# EAGLE design pc_healthypi_pro_carrier_5.2 (EAGLE 9.6.2)
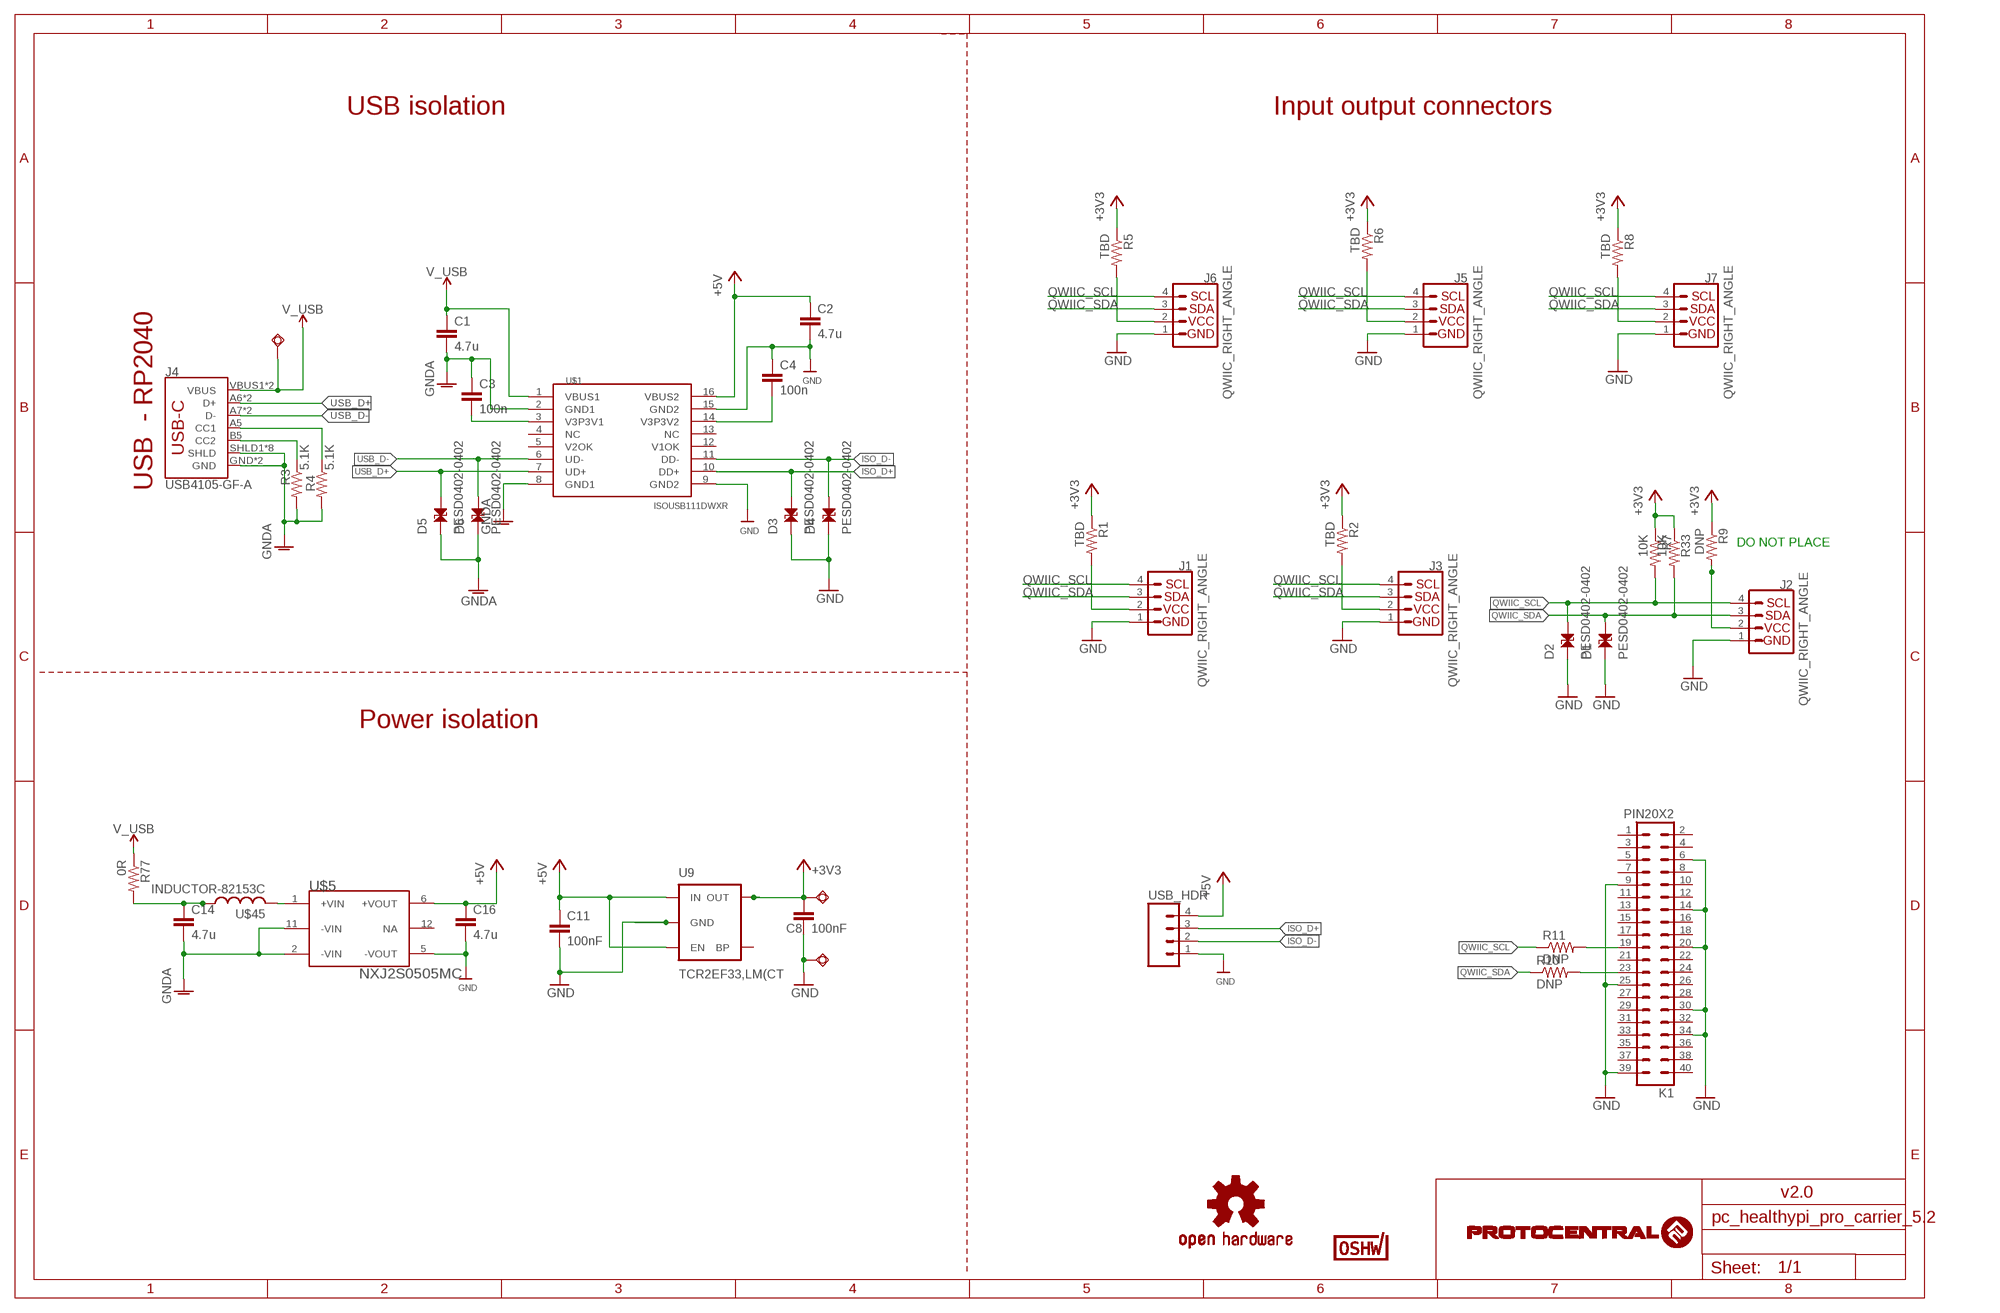
[diagram p0: schematic, sheet 1]

## Parts
C1  4.7u  C-EUC0805  [C0805]
C2  4.7u  C-EUC0805  [C0805]
C3  100n  C-EUC0402  [C0402]
C4  100n  C-EUC0402  [C0402]
C8  100nF  C-EUC0402  [C0402]
C11  100nF  C-EUC0402  [C0402]
C14  4.7u  C-EUC0805  [C0805]
C16  4.7u  C-EUC0805  [C0805]
D1  PESD0402-0402  [0402]
D2  PESD0402-0402  [0402]
D3  PESD0402-0402  [0402]
D4  PESD0402-0402  [0402]
D5  PESD0402-0402  [0402]
D6  PESD0402-0402  [0402]
J1  QWIIC_RIGHT_ANGLE  QWIIC_CONNECTORJS-1MM  [JST04_1MM_RA]
J2  QWIIC_RIGHT_ANGLE  QWIIC_CONNECTORJS-1MM  [JST04_1MM_RA]
J3  QWIIC_RIGHT_ANGLE  QWIIC_CONNECTORJS-1MM  [JST04_1MM_RA]
J4  USB4105-GF-A  USB_C16PIN  [USB-C-16P]
J5  QWIIC_RIGHT_ANGLE  QWIIC_CONNECTORJS-1MM  [JST04_1MM_RA]
J6  QWIIC_RIGHT_ANGLE  QWIIC_CONNECTORJS-1MM  [JST04_1MM_RA]
J7  QWIIC_RIGHT_ANGLE  QWIIC_CONNECTORJS-1MM  [JST04_1MM_RA]
K1  PIN20X2  [PIN_20X2]
R1  TBD  R-US_R0402  [R0402]
R2  TBD  R-US_R0402  [R0402]
R3  5.1K  R-US_R0402  [R0402]
R4  5.1K  R-US_R0402  [R0402]
R5  TBD  R-US_R0402  [R0402]
R6  TBD  R-US_R0402  [R0402]
R7  10K  R-US_R0402  [R0402]
R8  TBD  R-US_R0402  [R0402]
R9  DNP  R-US_R0402  [R0402]
R10  DNP  R-US_R0402  [R0402]
R11  DNP  R-US_R0402  [R0402]
R33  10K  R-US_R0402  [R0402]
R77  0R  R-US_R0805  [R0805]
SWIO5  TPSQTP11R  [TP11R]
SWIO6  TPSQTP11R  [TP11R]
TP8  TPSQTP11R  [TP11R]
U9  TCR2EF33,LM(CT  V_REG_LDOSMD  [SOT23-5]
U$1  ISOUSB111DWXR  [SSOP-16-5.85X7.5]
U$5  NXJ2S0505MC  [NXJ2S0505MC]
U$13  CERT-SMALL  [CERT-SMALL-SILK]
U$42  OSHW-LOGOM  [OSHW-LOGO-M]
U$45  INDUCTOR-82153C  [INDUCTOR-8200]
USB_HDR  M04LOCK_LONGPADS  [1X04_LOCK_LONGPADS]

## Nets
+3V3: C8.1 R1.1 R2.1 R5.1 R6.1 R7.1 R8.1 R9.1 R33.1 SWIO5.TP U9.5(OUT)
+5V: C2.1 C11.1 C16.1 U9.1(IN) U9.3(EN) U$1.16(VBUS2) U$5.6(+VOUT) USB_HDR.4
GND: C2.2 C4.1 C8.2 C11.2 C16.2 D1.1 D2.1 D3.1 D4.1 J1.1 J2.1 J3.1 J5.1 J6.1 J7.1 K1.6 K1.9 K1.14 K1.20 K1.25 K1.30 K1.34 K1.39 SWIO6.TP U9.2(GND) U$1.9(GND2) U$1.15(GND2) U$5.5(-VOUT) USB_HDR.1
GNDA: C1.2 C3.1 C14.2 D5.1 D6.1 J4.GND J4.GND2(GND) J4.SHLD1(SHLD) J4.SHLD2(SHLD) J4.SHLD3(SHLD) J4.SHLD4(SHLD) J4.SHLD5(SHLD) J4.SHLD6(SHLD) J4.SHLD7(SHLD) J4.SHLD8(SHLD) R3.2 R4.2 U$1.2(GND1) U$1.8(GND1) U$5.2(-VIN) U$5.11(-VIN)
ISO_D+: D3.2 U$1.10(DD+) USB_HDR.3
ISO_D-: D4.2 U$1.11(DD-) USB_HDR.2
N$1: J1.2 R1.2
N$2: J3.2 R2.2
N$3: J6.2 R5.2
N$4: J5.2 R6.2
N$5: J7.2 R8.2
N$6: J2.2 R9.2
N$7: C3.2 U$1.3(V3P3V1)
N$8: C4.2 U$1.14(V3P3V2)
N$29: K1.23 R10.2
N$30: K1.19 R11.2
N$33: J4.B5(CC2) R3.1
N$34: J4.A5(CC1) R4.1
N$39: U$5.1(+VIN) U$45.P$2
N$46: C14.1 R77.2 U$45.P$1
QWIIC_SCL: D2.2 J1.4 J2.4 J3.4 J5.4 J6.4 J7.4 R7.2 R11.1
QWIIC_SDA: D1.2 J1.3 J2.3 J3.3 J5.3 J6.3 J7.3 R10.1 R33.2
USB_D+: D5.2 J4.A6(D+) J4.B6(D+) U$1.7(UD+)
USB_D-: D6.2 J4.A7(D-) J4.B7(D-) U$1.6(UD-)
V_USB: C1.1 J4.VBUS1(VBUS) J4.VBUS2(VBUS) R77.1 TP8.TP U$1.1(VBUS1)
Unconnected: K1.1 K1.2 K1.3 K1.4 K1.5 K1.7 K1.8 K1.10 K1.11 K1.12 K1.13 K1.15 K1.16 K1.17 K1.18 K1.21 K1.22 K1.24 K1.26 K1.27 K1.28 K1.29 K1.31 K1.32 K1.33 K1.35 K1.36 K1.37 K1.38 K1.40 U9.4(BP) U$1.4(NC) U$1.5(V2OK) U$1.12(V1OK) U$1.13(NC) U$5.12(NA)

## Notes on the sheet
- USB isolation | Input output connectors
- USB  - RP2040
- DO NOT PLACE
- Power isolation
- v2.0

## Library data of the parts
C1-C4 C8 C11 C14 C16 = rcl:C-EU: CAPACITOR, European symbol; SPICEPREFIX: C
D1-D6 = SparkFun-DiscreteSemi:PESD0402: ESD protection diode PESD is used to protect a signal line from ESD.; DIGIKEY_PART: PESD0402-140CT-ND; MOUSE_PART: 650-PESD0402-140; PROD_ID: DIO-15359
J1-J3 J5-J7 = SparkFun-Connectors:QWIIC_CONNECTOR: SparkFun I2C Standard Qwiic Connector An SMD 1mm pitch JST connector makes it easy and quick (get it? Qwiic?) to connect I2C devices to each other. The Qwiic system <http://www.sparkfun.com/qwiic> enables fast and solderless connection between popular platforms and various sensors and actuators. We carry 200mm <https://www.sparkfun.com/products/14204>, 100mm <https://www.sparkfun.com/products/14205>, 50mm <https://www.sparkfun.com/products/14206>, and breadboard friendly <https://www.sparkfun.com/products/14207> Qwiic cables. We also offer 10 pcs strips <https://www.sparkfun.com/products/14323> the SMD connectors.; PROD_ID: CONN-13694
J4 = circuitects:USB_C: USB Type C 16Pin Connector
K1 = FLYFISH:PIN20X2
R1-R11 R33 = rcl:R-US_: RESISTOR, American symbol; SPICEPREFIX: R
R77 = rcl:R-US_: RESISTOR, American symbol
SWIO5 SWIO6 TP8 = testpad:TPSQ: Test pad
U9 = SparkFun-PowerIC:V_REG_LDO: Voltage Regulator LDO Standard 150mA LDO voltage regulator in SOT-23 layout. Micrel part MIC5205. BP (by-pass) pin is used to lower output noise with 470pF cap.; PROD_ID: VREG-12457
U$1 = circuitects:ISOUSB111DWXR
U$5 = circuitects:NXJ2S0505MC
U$13 = OSHWA:CERT
U$42 = SparkFun:OSHW-LOGO: Open Source Hardware Logo This logo indicates the piece of hardware it is found on incorporates a OSHW license and/or adheres to the definition of open source hardware found here: http://freedomdefined.org/OSHW
U$45 = circuitects:INDUCTOR-82153C
USB_HDR = SparkFun:M04: Header 4 Standard 4-pin 0.1" header. Use with straight break away headers (SKU : PRT-00116), right angle break away headers (PRT-00553), swiss pins (PRT-00743), machine pins (PRT-00117), and female headers (PRT-00115). Molex polarized connector foot print use with SKU : PRT-08231 with associated crimp pins and housings. 1MM SMD Version SKU: PRT-10208

## Net classes
1 power: width 0.178 mm
2 Clock: width 0.089 mm, clearance 0.178 mm
4 USBpair: width 0.102 mm, drill 0.1 mm, clearance 0.15 mm to class 3

## Board
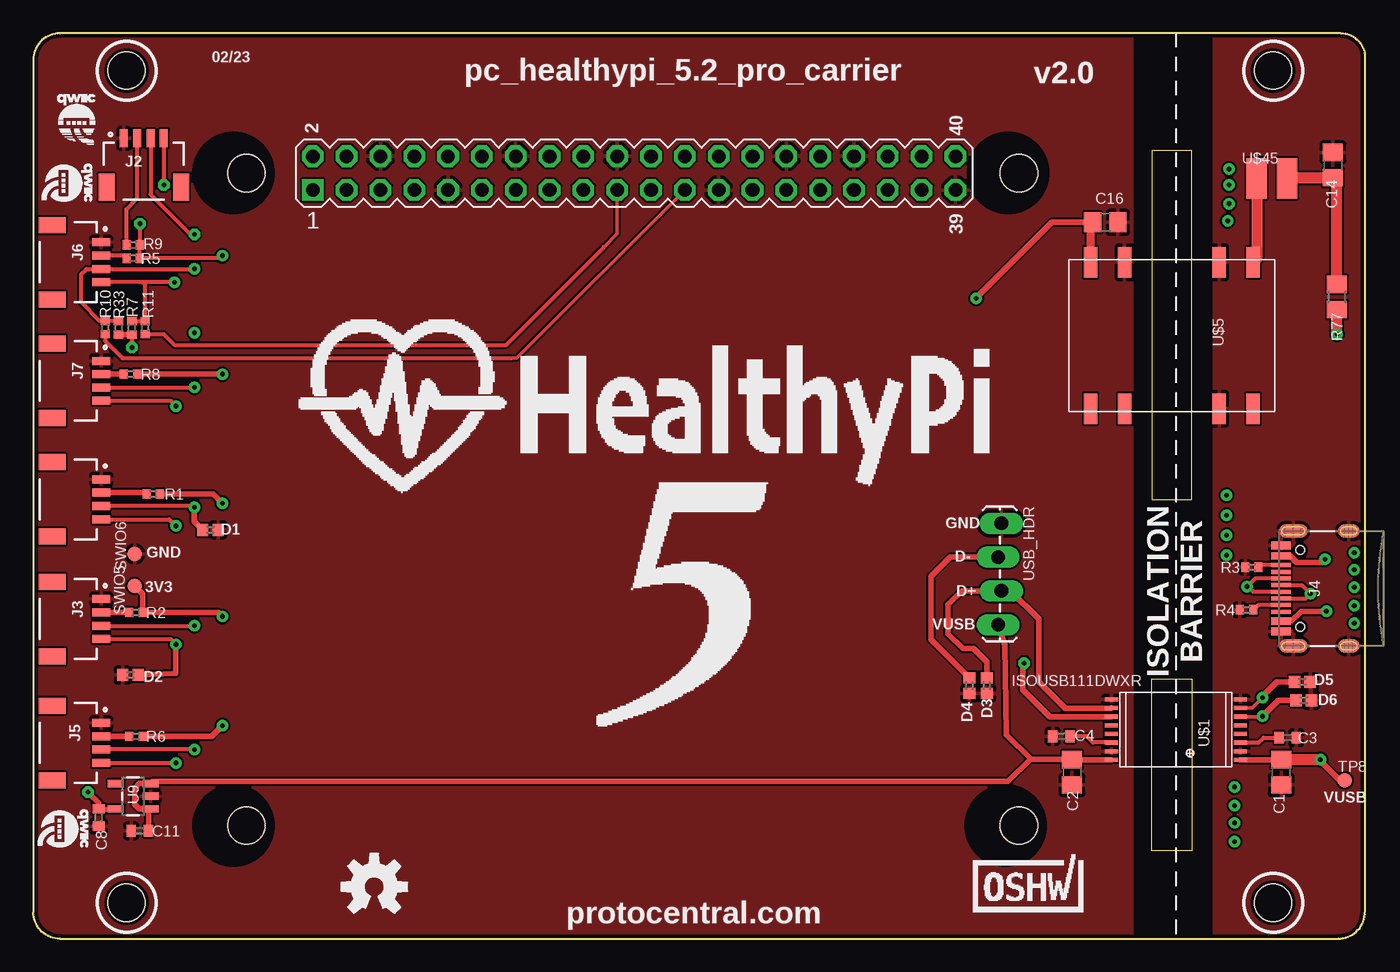
[diagram p1: board, top side]
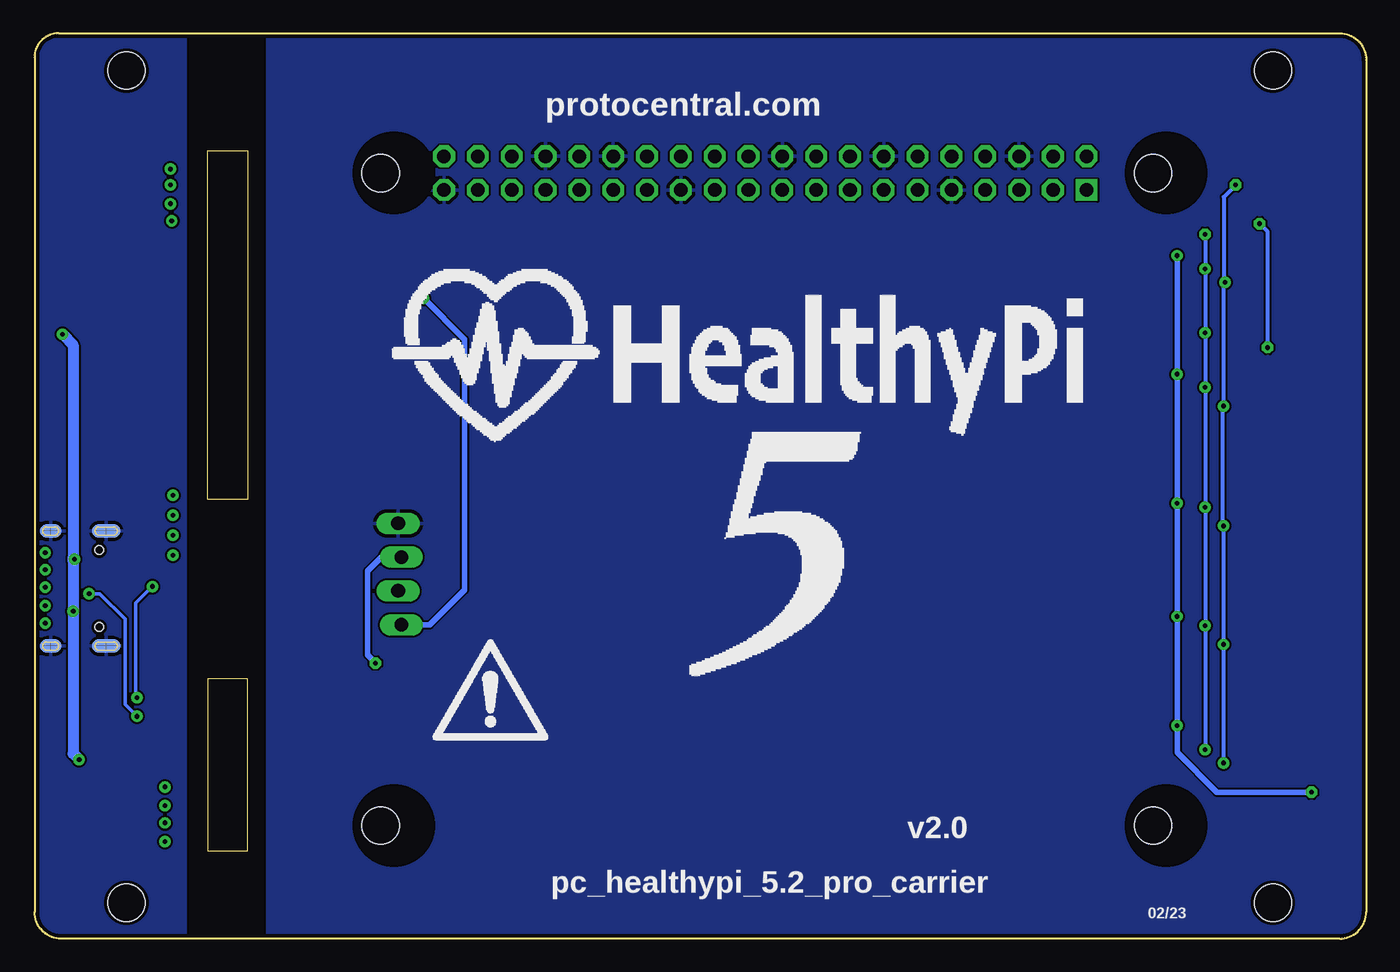
[diagram p2: board, bottom side, seen from below]

Size 100 x 68 mm. Coordinates in mm from the lower left corner, seen from the top.
Outline: 0,66 0,2 arc90 2,0 98,0 arc90 100,2 100,66.2 arc90 98.2,68 2,68 arc90 0,66
Outline: 84,59.2 84,33 87,33 87,59.2 84,59.2
Outline: 84,19.5 87,19.5 87,6.6 84,6.6 84,19.5
Copper layers (1*16): Top 0.035mm / dielectric 1.5mm / Bottom 0.035mm
Design rules "Circuitects-Rules *": minimum track width 6mil, minimum drill 0.1mm, track to track 6mil, track to pad 6mil, pad to pad 6mil, via to via 6mil, smd to smd 6mil, copper to edge 10mil, drill to drill 4mil, minimum pad ring 12mil, minimum via ring 10mil, stop-mask expansion 4mil, vias tented up to drill 25mil, thermal gap 10mil
Holes 2.8 mm at 16.02,8.5 16.02,57.5 74.02,57.5 74.02,8.5 7,2.7 93.1,2.7 7,65.2 93.1,65.2
tRestrict: area 13.5,55.9 to 16.6,59; area 71.7,55.9 to 74.8,59; area 71.5,6.9 to 74.6,10; area 13.5,6.9 to 16.6,10
bRestrict: area 13.5,6.9 to 16.6,10; area 13.5,55.9 to 16.6,59; area 71.5,6.9 to 74.6,10; area 71.5,55.9 to 74.6,59

### Footprints (pad centres in the part's own frame; a part is rotated, then mirrored left to right if it is on the bottom)
C0805 = smd 1.3 x 1.5: 1 -0.95,0; 2 0.95,0
C0402 = smd 0.7 x 0.9: 1 -0.65,0; 2 0.65,0
0402 = smd 0.85 x 0.9: 1 -0.58,0; 2 0.58,0
JST04_1MM_RA = smd 0.6 x 1.35: 1 -1.5,0; 2 -0.5,0; 3 0.5,0; 4 1.5,0 | smd 1.2 x 2: NC1 2.8,-3.675; NC2 -2.8,-3.675
USB-C-16P = smd 0.3 x 1.45: A5 -1.25,0; A6 -0.25,0; A7 0.25,0; A8 1.25,0; B5 1.75,0; B6 0.75,0; B7 -0.75,0; B8 -1.75,0 | smd 0.6 x 1.45: GND -3.225,0; GND2 3.225,0 | smd 1 x 2.1: SHLD1 -4.32,-0.915; SHLD2 4.32,-0.915 | smd 1 x 2.1 bottom: SHLD3 -4.32,-0.915; SHLD4 4.32,-0.915 | smd 1 x 1.6: SHLD5 -4.32,-5.095; SHLD8 4.32,-5.095 | smd 1 x 1.6 bottom: SHLD6 -4.32,-5.095; SHLD7 4.32,-5.095 | smd 0.55 x 1.45: VBUS1 -2.45,0; VBUS2 2.45,0 | hole 0.65: -2.89,-1.445; 2.89,-1.445
PIN_20X2 = drill 1.016 square: 1 -24.13,-1.27 | drill 1.016 octagon: 2 -24.13,1.27; 3 -21.59,-1.27; 4 -21.59,1.27; 5 -19.05,-1.27; 6 -19.05,1.27; 7 -16.51,-1.27; 8 -16.51,1.27; 9 -13.97,-1.27; 10 -13.97,1.27; 11 -11.43,-1.27; 12 -11.43,1.27; 13 -8.89,-1.27; 14 -8.89,1.27; 15 -6.35,-1.27; 16 -6.35,1.27; 17 -3.81,-1.27; 18 -3.81,1.27; 19 -1.27,-1.27; 20 -1.27,1.27; 21 1.27,-1.27; 22 1.27,1.27; 23 3.81,-1.27; 24 3.81,1.27; 25 6.35,-1.27; 26 6.35,1.27; 27 8.89,-1.27; 28 8.89,1.27; 29 11.43,-1.27; 30 11.43,1.27; 31 13.97,-1.27; 32 13.97,1.27; 33 16.51,-1.27; 34 16.51,1.27; 35 19.05,-1.27; 36 19.05,1.27; 37 21.59,-1.27; 38 21.59,1.27; 39 24.13,-1.27; 40 24.13,1.27
R0402 = smd 0.6 x 0.7: 1 -0.5,0; 2 0.5,0
R0805 = smd 1.3 x 1.5: 1 -0.95,0; 2 0.95,0
TP11R = smd 1.1 x 1.1: TP 0,0
SOT23-5 = smd 0.55 x 1.2: 1 -0.95,-1.3; 2 0,-1.3; 3 0.95,-1.3; 4 0.95,1.3; 5 -0.95,1.3
SSOP-16-5.85X7.5 = smd 0.991 x 0.305: 1 -4.85,2.275; 2 -4.85,1.625; 3 -4.85,0.975; 4 -4.85,0.325; 5 -4.85,-0.325; 6 -4.85,-0.975; 7 -4.85,-1.625; 8 -4.85,-2.275; 9 4.85,-2.275; 10 4.85,-1.625; 11 4.85,-0.975; 12 4.85,-0.325; 13 4.85,0.325; 14 4.85,0.975; 15 4.85,1.625; 16 4.85,2.275
NXJ2S0505MC = smd 1 x 2.3: 1 -6.095,-5.5; 2 -3.55,-5.5; 5 3.55,-5.5; 6 6.095,-5.5; 7 6.095,5.5; 8 3.55,5.5; 11 -3.55,5.5; 12 -6.095,5.5
INDUCTOR-8200 = smd 1.52 x 3.05: P$1 -1.145,0; P$2 1.145,0
1X04_LOCK_LONGPADS = drill 1.016 long: 1 0,0; 2 2.54,-0.254; 3 5.08,0; 4 7.62,-0.254

### Placement (x,y rotation side)
C1  93.7,12.5 270 top
C2  78,12.5 270 top
C3  94.2,15.1 180 top
C4  77.2,15.2 0 top
C8  4.9,9.1 270 top
C11  8,8.1 180 top
C14  97.6,58.1 90 top
C16  80.5,53.8 0 top
D1  13.3,30.7 180 top
D2  7.3,19.8 0 top
D3  71.6,19 90 top
D4  70.3,19 90 top
D5  95.3,19.3 180 top
D6  95.4,17.9 180 top
J1  5.1,33 270 top
J2  8.3,60.12 0 top
J3  5.1,24 270 top
J4  93.7,26.3 90 top
J5  5.1,14.7 270 top
J6  5.1,50.8 270 top
J7  5.1,41.9 270 top
K1  45.12,57.5 0 top
R1  9,33.4 180 top
R2  7.7,24.5 180 top
R3  91.5,27.9 180 top
R4  91.1,24.7 180 top
R5  7.5,51.1 180 top
R6  7.7,15.2 180 top
R7  7.4,45.88 90 top
R8  7.3,42.4 180 top
R9  7.5,52.1 180 top
R10  5.4,45.9 270 top
R11  8.4,45.9 270 top
R33  6.4,45.88 90 top
R77  97.9,48.2 90 top
SWIO5  7.6,26.5 90 top
SWIO6  7.6,28.9 90 top
TP8  98.5,11.9 0 top
U9  7.5,10.7 90 top
U$1  85.8,15.7 180 top
U$5  85.5,45.3 180 top
U$6  [QWIIC#LABEL#FULL#M#PNG]  2.53,56.83 270 top
U$7  [HEALTHYPIV5LOGO]  20,16 0 top
U$13  74.7,2 0 top
U$15  [QWIIC#LABEL#FULL#M#PNG]  3.17,61.53 0 top
U$17  [WARNINGSYM]  70.2,14.8 0 bottom
U$20  [HEALTHYPIV5LOGO]  73.1,19.8 0 bottom
U$42  25.6,3.9 0 top
U$45  93,57.1 180 top
U$59  [QWIIC#LABEL#FULL#M#PNG]  2.23,8.33 270 top
USB_HDR  72.7,31.2 270 top

### Tracks (layer width: path | path; a pad name or v marks a point on that pad's centre or on a via)
+3V3  (via drill 0.35)
  Top 0.305: v14.2,51.3 14,51.1 R5.1 R9.1 v8,53.7 | R7.1 v7.4,44.4
  Top 0.406: R8.1 v14.2,42.4 | R6.1 13.4,15.2 v14.2,16 | R1.1 13.5,33.4 v14.2,32.7 | v14.2,24.2 13.9,24.5 R2.1 8.2,25.9 SWIO5.TP | U9.5 5,9.67 C8.1 4.9,10.2 v4.1,11 | R33.1 R7.1
  Bottom 0.305: v7.4,44.4 7.4,53.1 v8,53.7
  Bottom 0.406: v14.2,51.3 v14.2,42.4 v14.2,32.7 v14.2,24.2 v14.2,16 14.2,14 11.2,11 v4.1,11
+5V  (via drill 0.35)
  Top 0.406: U$1.16 78.03,13.43 C2.1 | 77.95,13.5 C2.1 | 79.41,53.01 C16.1 76.5,53.8 v70.8,48.1 | C2.1 74.95,13.45 74.9,13.5 | USB_HDR.4 72.98,22.05 73.08,15.32 74.9,13.5 | 74.9,13.5 73.2,11.8 8.95,11.8 U9.3 7.95,11.65 7.6,11.3 7.6,10.1 7.95,9.75 U9.1 8.65,9.6 C11.1
  Top 0.61: U$5.6 79.41,53.01
  Bottom 0.406: USB_HDR.4 70.32,23.58 67.7,26.2 67.7,45 v70.8,48.1
GND
  pour Bottom: -1,-0.2 82.5,-0.2 82.5,68 0.84,68 arc90 -1,65.47
  pour Top: -1,-0.2 82.5,-0.2 82.5,68 -1,68
GNDA
  pour Top: 88.7,68 101,68 101,0 88.7,0
  pour Bottom: 88.7,68 88.7,0 101,0 101,68
ISO_D+
  Top 0.406: U$1.10 80.92,17.3 77.5,17.3 75.5,19.3 75.5,24 73.38,26.12 USB_HDR.3 69.72,26.12 68.7,25.1 68.7,22.9 69.8,21.8 70.6,21.8 71.6,20.8 D3.2
ISO_D-  (via drill 0.35)
  Top 0.406: U$1.11 76.33,16.68 74.3,18.7 74.3,20.6 v74.4,20.7 | D4.2 67.4,22.48 67.4,27.2 68.86,28.66 USB_HDR.2
  Bottom 0.406: v74.4,20.7 75,21.3 75,27.6 73.94,28.66 USB_HDR.2
N$1
  Top 0.152: R1.2 8.4,33.5
  Top 0.406: 8.4,33.5 J1.2
N$2
  Top 0.406: R2.2 J3.2
N$3
  Top 0.305: J6.2 5.3,51.3 | 5.3,51.3 | R5.2 6.8,51.3 5.3,51.3
N$4
  Top 0.406: R6.2 J5.2
N$5
  Top 0.406: J7.2 R8.2
N$6
  Top 0.305: R9.2 7,54.8 7.8,55.6 J2.2
N$7
  Top 0.305: U$1.3 92.03,14.72 92.4,15.1 C3.2
N$8
  Top 0.305: U$1.14 79.58,14.72 79.1,15.2 C4.2
N$10  (via drill 0.35)
  other vias: 90.2,11.4
N$11  (via drill 0.35)
  other vias: 90.2,10
N$12  (via drill 0.35)
  other vias: 90.2,8.7
N$13  (via drill 0.35)
  other vias: 90.2,7.3
N$14  (via drill 0.35)
  other vias: 99.2,29
N$15  (via drill 0.35)
  other vias: 99.2,27.7
N$16  (via drill 0.35)
  other vias: 99.2,26.4
N$17  (via drill 0.35)
  other vias: 99.2,25
N$18  (via drill 0.35)
  other vias: 99.2,23.7
N$19  (via drill 0.35)
  other vias: 89.8,57.8
N$20  (via drill 0.35)
  other vias: 89.7,53.9
N$21  (via drill 0.35)
  other vias: 89.8,55.2
N$23  (via drill 0.35)
  other vias: 89.8,56.6
N$25  (via drill 0.35)
  other vias: 89.6,33.3
N$26  (via drill 0.35)
  other vias: 89.6,31.8
N$27  (via drill 0.35)
  other vias: 89.6,30.3
N$28  (via drill 0.35)
  other vias: 89.6,28.8
N$29
  Top 0.254: 35.9,43.6 36.3,43.6 K1.23
  Top 0.305: R10.2 5.4,44.9 6.7,43.6 35.9,43.6
N$30
  Top 0.254: 42.85,51.95 43.85,52.95 K1.19
  Top 0.305: R11.2 9.8,45.4 10.6,44.6 35.5,44.6 42.85,51.95
N$33
  Top 0.152: 92.15,28.05 R3.1
  Top 0.305: J4.B5 92.15,28.05
N$34
  Top 0.305: J4.A5 91.98,25.05 R4.1
N$39
  Top 0.406: 91.89,57.06 U$45.P$2
  Top 0.61: U$5.1 91.89,51.1
  Top 0.813: 91.89,57.06 91.89,51.1
N$46
  Top 0.406: U$45.P$1 94.19,57.15
  Top 0.813: 94.19,57.15 C14.1 97.9,56.85 R77.2
QWIIC_SCL  (via drill 0.35)
  Top 0.305: J5.4 v10.7,13.2 | v10.6,49.3 8.2,49.3 | 8.2,49.3 J6.4 | J7.4 10.3,40.4 v10.7,40 | J1.4 10.2,31.5 v10.7,31 | J3.4 10.3,22.5 v10.7,22.1 | 8.2,49.3 8.4,49.1 R11.1 7.42,46.4 R7.2 | J2.4 9.8,56.8 v9.8,56.6
  Top 0.406: v10.7,22.1 10.7,19.92 D2.2
  Bottom 0.305: v10.7,13.2 v10.7,22.1 v10.7,31 10.8,31.1 10.8,40 v10.7,40 10.7,49.3 | 10.7,49.3 v10.6,49.3 | v9.8,56.6 10.7,55.7 10.7,49.3
QWIIC_SDA  (via drill 0.35)
  Top 0.305: v12.1,50.3 J6.3 4,50.3 3.6,49.9 3.6,47.8 5,46.4 R10.1 5.42,46.38 R33.2 | v12.1,14.2 J5.3 | J3.3 v12.1,23.5 | v12.1,32.4 12,32.5 J1.3 | J7.3 v12.1,41.4 | J2.3 8.8,55.9 11.8,52.9 v12.1,52.9
  Top 0.406: v12.1,32.4 12.1,31.32 D1.2
  Bottom 0.305: v12.1,14.2 v12.1,23.5 v12.1,32.4 v12.1,41.4 v12.1,45.5 v12.1,50.3 v12.1,52.9
USB_D+  (via drill 0.35)
  Top 0.254: v92.3,18.1 91.53,17.32 U$1.7
  Top 0.305: J4.B6 91.75,27.05 v91.15,26.45 91.2,26.45 91.6,26.05 J4.A6
  Top 0.406: D5.2 93.33,19.3 93.32,19.22 92.3,18.2 v92.3,18.1
  Bottom 0.254: v92.3,18.1 92.4,18.2 92.4,25.2 v91.15,26.45
USB_D-  (via drill 0.35)
  Top 0.254: v92.3,16.7 92.28,16.68 U$1.6
  Top 0.305: J4.A7 95.25,26.55 v95.9,25.9 95.55,25.55 J4.B7
  Top 0.406: D6.2 93.5,17.9 v92.3,16.7
  Bottom 0.254: v95.9,25.9 95.1,25.9 93.2,24 93.2,17.6 v92.3,16.7
V_USB  (via drill 0.35)
  Top 0.406: J4.VBUS2 94.4,28.75 94.9,28.25 96.75,28.25 v97,28.5 | J4.VBUS1 94.48,23.85 95.22,24.59 v97.09,24.59 v97.1,24.6 | U$1.1 93.67,13.43 C1.1 | 96.55,13.45 96.6,13.4 | 96.6,13.4 v96.65,13.45 | TP8.TP 98.1,11.9 96.6,13.4
  Top 0.813: v97.9,45.4 R77.1 | C1.1 96.55,13.45
  Bottom 0.813: v96.65,13.45 97.1,13.9 v97.1,24.6 97.1,28.4 v97,28.5 97.1,28.6 97.1,44.6 v97.9,45.4

### Text on the board
tPlace: 02/23 | pc_healthypi_5.2_pro_carrier | v2.0 | 2 | 40 | 39 | GND | GND | D- | 3V3 | D+ | ISOLATION / BARRIER | VUSB | VUSB | protocentral.com
bPlace: protocentral.com | v2.0 | pc_healthypi_5.2_pro_carrier | 02/23